# EAGLE design switch_v2 (EAGLE 7.3.0)
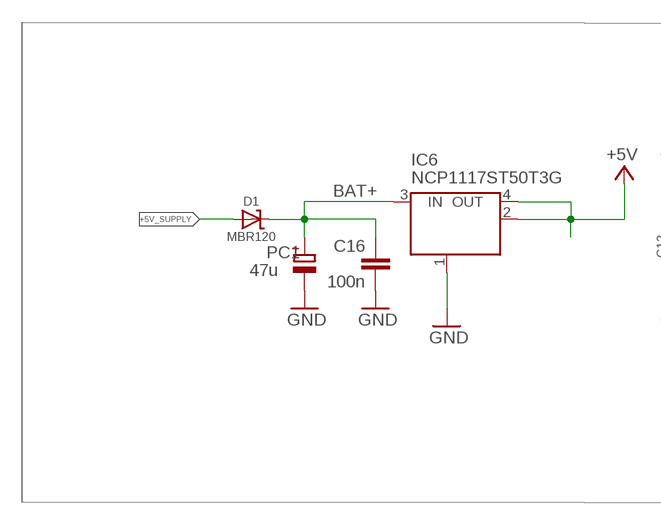
[diagram p0: schematic, sheet 1, part 1 of 2]
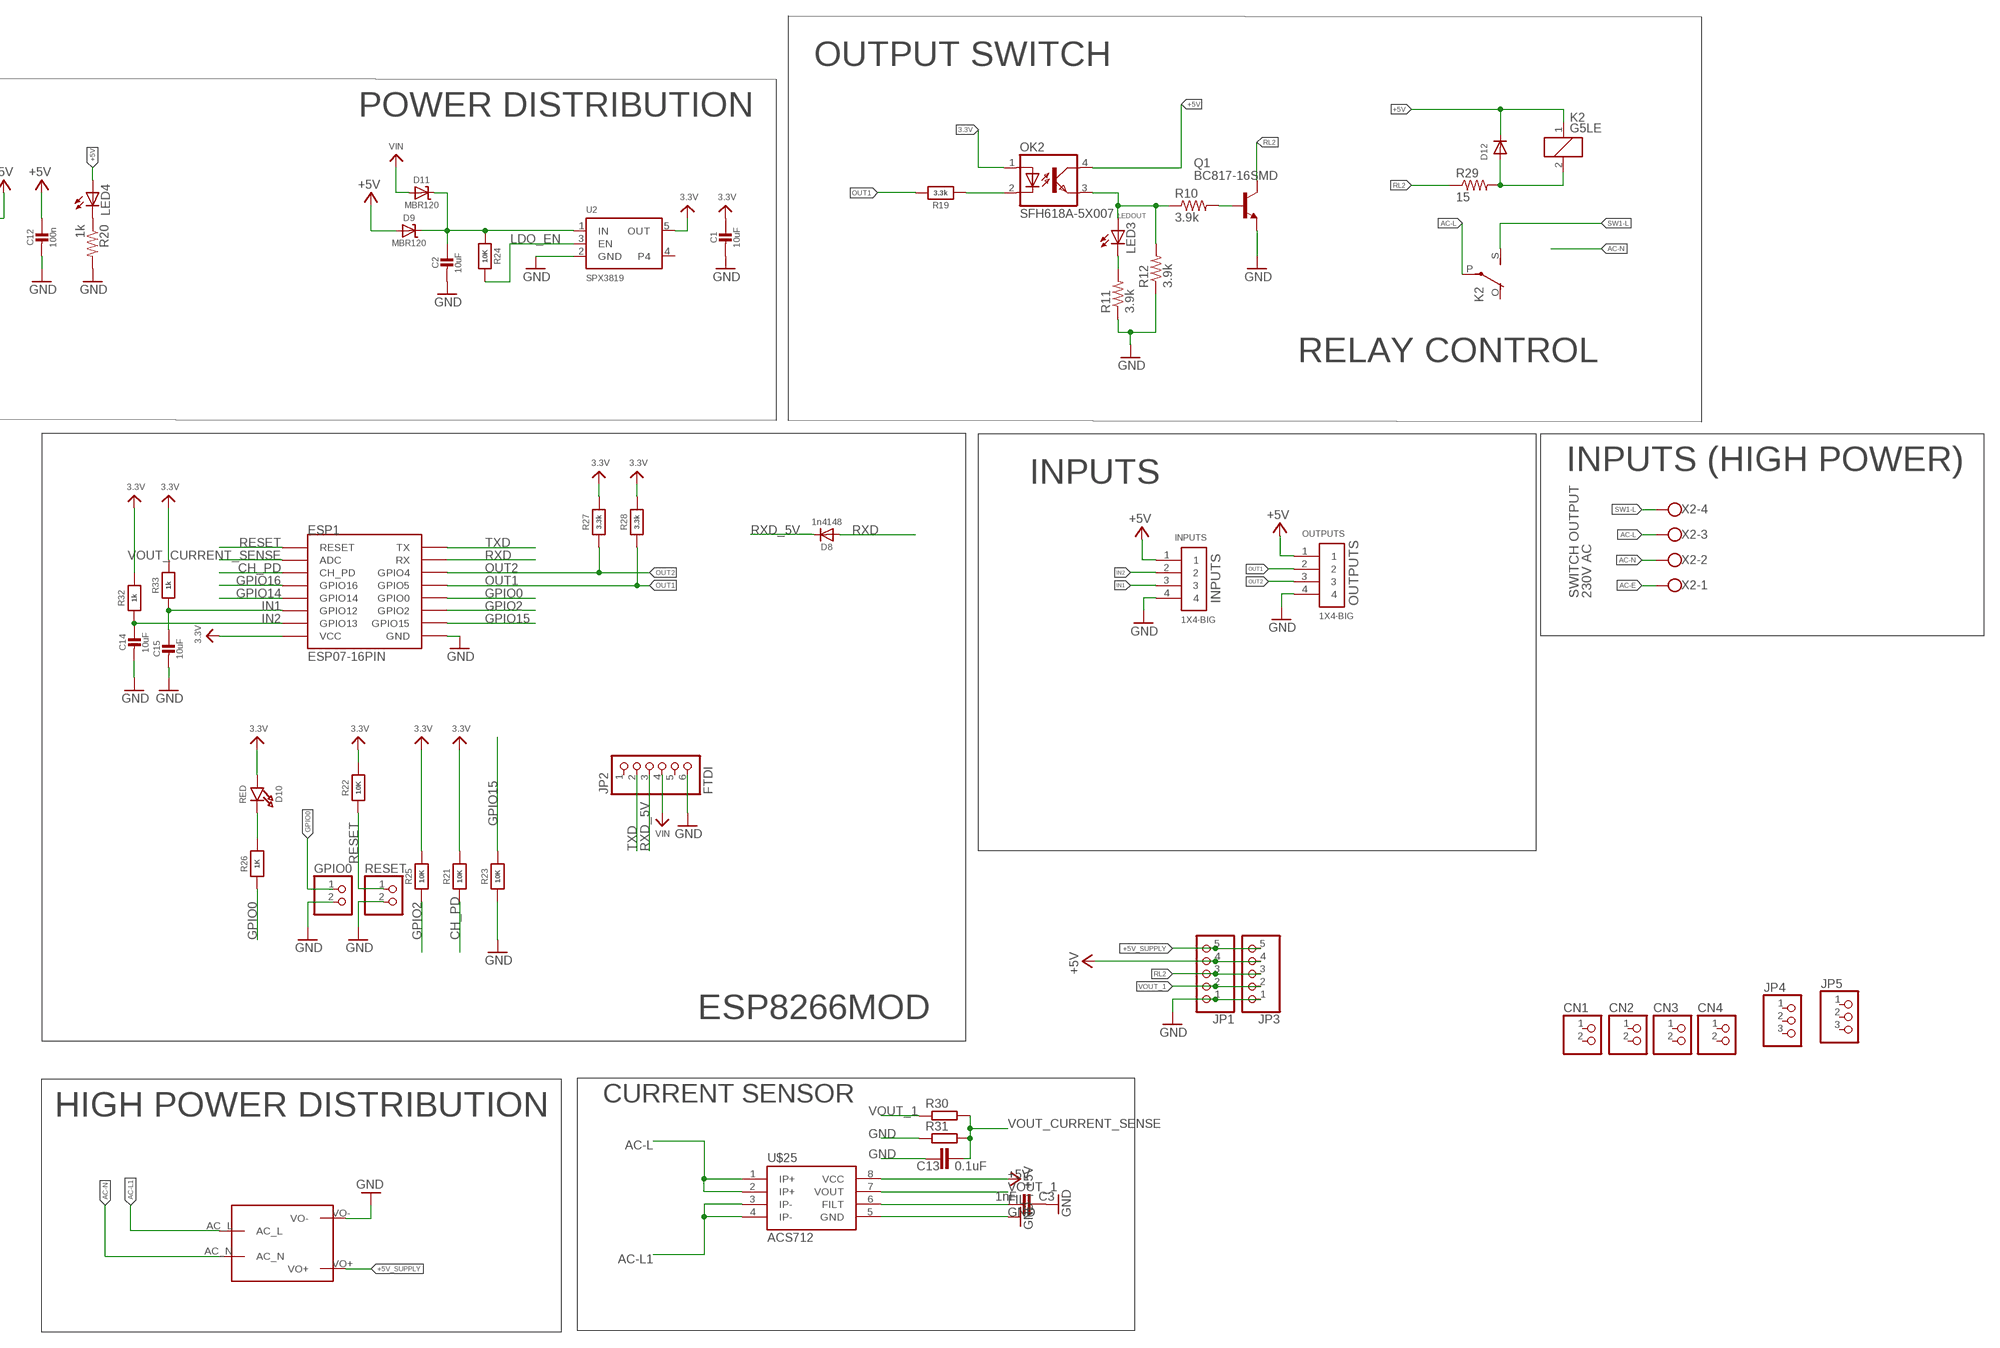
[diagram p1: schematic, sheet 1, part 2 of 2]

## Parts
C1  10uF  CAP_CERAMIC_0603  [_0603]
C2  10uF  CAP_CERAMIC_0603  [_0603]
C3  1nF  C-EU0603-RND  [C0603-ROUND]
C12  100n  CAP_CERAMIC_0603  [_0603]
C13  0.1uF  C-EU0603-RND  [C0603-ROUND]
C14  10uF  CAP_CERAMIC_0603  [_0603]
C15  10uF  CAP_CERAMIC_0603  [_0603]
C16  100n  C-EU0603-RND  [C0603-ROUND]
CN1  PINHD-1X2  [1X02]
CN2  PINHD-1X2  [1X02]
CN3  PINHD-1X2  [1X02]
CN4  PINHD-1X2  [1X02]
D1  MBR120  DIODE-SCHOTTKYSOD-123  [SOD-123]
D8  1n4148  DIODESOD-323  [SOD-323]
D9  MBR120  DIODE-SCHOTTKYSOD-123  [SOD-123]
D10  RED  LED0603_NOOUTLINE  [CHIPLED_0603_NOOUTLINE]
D11  MBR120  DIODE-SCHOTTKYSOD-123  [SOD-123]
D12  DIODESOD-523  [SOD-523]
ESP1  ESP07-16PIN  [ESP07-16PIN]
GPIO0  PINHD-1X2  [1X02]
IC6  NCP1117ST50T3G  MC33269ST-3.3T3  [SOT223]
INPUTS  1X4-BIG  [1X04-BIG]
JP1  PINHD-1X5  [1X05]
JP2  FTDI  HEADER-1X670MIL  [1X06_ROUND_70]
JP3  PINHD-1X5  [1X05]
JP4  PINHD-1X3  [1X03]
JP5  PINHD-1X3  [1X03]
K2  G5LE  [G5LE]
LED3  LEDCHIP-LED0603  [CHIP-LED0603]
LED4  LEDCHIP-LED0603  [CHIP-LED0603]
OK2  SFH618A-5X007  [SMD4-7]
OUTPUTS  1X4-BIG  [1X04-BIG]
PC1  47u  CPOL-EUD  [PANASONIC_D]
Q1  BC817-16SMD  [SOT23-BEC]
R10  3.9k  R-US_R0603  [R0603]
R11  3.9k  R-US_R0603  [R0603]
R12  3.9k  R-US_R0603  [R0603]
R19  3.3k  RESISTOR_0603MP  [_0603MP]
R20  1k  R-US_R0603  [R0603]
R21  10K  RESISTOR_0603_NOOUT  [0603-NO]
R22  10K  RESISTOR_0603_NOOUT  [0603-NO]
R23  10K  RESISTOR_0603_NOOUT  [0603-NO]
R24  10K  RESISTOR_0603_NOOUT  [0603-NO]
R25  10K  RESISTOR_0603_NOOUT  [0603-NO]
R26  1K  RESISTOR_0603_NOOUT  [0603-NO]
R27  3.3k  RESISTOR_0603  [_0603]
R28  3.3k  RESISTOR_0603  [_0603]
R29  15  R-US_R0603  [R0603]
R30  R-EU_R0603  [R0603]
R31  R-EU_R0603  [R0603]
R32  1k  RESISTOR_0603  [_0603]
R33  1k  RESISTOR_0603  [_0603]
RESET  PINHD-1X2  [1X02]
U2  SPX3819  VREG_SOT23-5  [SOT23-5]
U$24  MAINS_CONVERTERS  [HLK-PM01]
U$25  ACS712  [SO08]
X2  W237-4  [W237-4]

## Nets
3.3V: C1.1 D10.A ESP1.VCC OK2.1(A) R21.2 R22.2 R25.2 R27.2 R28.2 R32.2 R33.2 U2.5(OUT)
+5V: C12.1 D9.A D12.K(C) IC6.2(OUT) IC6.4(OUT) INPUTS.1 JP1.4 JP3.4 K2.1 LED4.A OK2.4(COL) OUTPUTS.1 U$25.8(VCC)
+5V_SUPPLY: D1.A JP1.5 JP3.5 U$24.VO+
AC-E: X2.1
AC-L: K2.P(2:P) U$25.1(IP+) U$25.2(IP+) X2.3
AC-L1: U$24.AC_L U$25.3(IP-) U$25.4(IP-)
AC-N: U$24.AC_N X2.2
BAT+ [power]: C16.1 D1.C IC6.3(IN) PC1.+
CH_PD: ESP1.CH_PD R21.1
FILT: C3.2 U$25.6(FILT)
GND: C1.2 C2.2 C3.1 C12.2 C13.1 C14.2 C15.2 C16.2 ESP1.GND GPIO0.2 IC6.1(GND/ADJ) INPUTS.4 JP1.1 JP2.6 JP3.1 OUTPUTS.4 PC1.- Q1.E R11.1 R12.1 R20.2 R23.1 R31.1 RESET.2 U2.2(GND) U$24.VO- U$25.5(GND)
GPIO0: ESP1.GPIO0 GPIO0.1 R26.1
GPIO2: ESP1.GPIO2 R25.1
GPIO14: ESP1.GPIO14
GPIO15: ESP1.GPIO15 R23.2
GPIO16: ESP1.GPIO16
IN1: C15.1 ESP1.GPIO12 INPUTS.3 R33.1
IN2: C14.1 ESP1.GPIO13 INPUTS.2 R32.1
LDO_EN: R24.2 U2.3(EN)
LEDOUT [power]: LED3.A OK2.3(EMIT) R10.1 R12.2
N$14: LED4.C R20.1
N$16: C2.1 D9.C D11.C R24.1 U2.1(IN)
N$26: D10.C R26.2
N$27 [power]: Q1.B R10.2
N$28 [power]: LED3.C R11.2
N$29: OK2.2(C) R19.1
N$30: D12.A K2.2 R29.2
OUT1: ESP1.GPIO5 OUTPUTS.2 R19.2 R28.1
OUT2: ESP1.GPIO4 OUTPUTS.3 R27.1
RESET: ESP1.REST(RESET) R22.1 RESET.1
RL2: JP1.3 JP3.3 Q1.C R29.1
RXD: D8.A ESP1.RX
RXD_5V: D8.C JP2.3
SW1-L: K2.S(2:S) X2.4
TXD: ESP1.TX JP2.2
VIN5V: D11.A JP2.4 ; supply symbol labelled VIN
VOUT_1: JP1.2 JP3.2 R30.1 U$25.7(VOUT)
VOUT_CURRENT_SENSE: C13.2 ESP1.ADC R30.2 R31.2
Unconnected: CN1.1 CN1.2 CN2.1 CN2.2 CN3.1 CN3.2 CN4.1 CN4.2 JP2.1 JP2.5 JP4.1 JP4.2 JP4.3 JP5.1 JP5.2 JP5.3 K2.O(2:O) U2.4

## Notes on the sheet
- OUTPUT SWITCH
- POWER DISTRIBUTION
- RELAY CONTROL
- INPUTS (HIGH POWER)
- INPUTS
- SWITCH OUTPUT | 230V AC
- INPUTS | OUTPUTS
- ESP8266MOD
- CURRENT SENSOR
- HIGH POWER DISTRIBUTION

## Library data of the parts
C1 C2 C12 C14 C15 = microbuilder:CAP_CERAMIC: Ceramic Capacitors For new designs, use the packages preceded by an '_' character since they are more reliable: The following footprints should be used on most boards: _0402 - Standard footprint for regular board layouts _0603 - Standard footprint for regular board layouts _0805 - Standard footprint for regular board layouts _1206 - Standard footprint for regular board layouts For extremely tight-pitch boards where space is at a premium, the following 'micro-pitch' footprints can be used (smaller pads, no silkscreen outline, etc.): _0402MP - Micro-pitch footprint for very dense/compact boards _0603MP - Micro-pitch footprint for very dense/compact boards _0805MP - Micro-pitch footprint for very dense/compact boards _1206MP - Micro-pitch footprint for very dense/compact boards
C3 C13 C16 = SmartPrj:C-EU: CAPACITOR, European symbol
CN1-CN4 GPIO0 RESET = pinhead:PINHD-1X2: PIN HEADER
D1 D9 D11 = microbuilder:DIODE-SCHOTTKY
D8 = microbuilder:DIODE: Diode
D10 = microbuilder:LED: LED
D12 = adafruit:DIODE: Diode
ESP1 = esp8266modules:ESP07-16PIN: ESP8266 Wifi module 07 - 16 pins; DIMENSIONS: 22.0 x 16.0 mm; PINS: 16; PITCH: 0.078" / 2 mm
IC6 = linear:MC33269ST*: Adjustable Output Low Dropout Voltage Regulator 800 mA Source: http://www.onsemi.com/pub/Collateral/MC33269-D.PDF
INPUTS OUTPUTS = adafruit:1X4: 4-pin connector
JP1 JP3 = pinhead:PINHD-1X5: PIN HEADER
JP2 = microbuilder:HEADER-1X6: PIN HEADER
JP4 JP5 = pinhead:PINHD-1X3: PIN HEADER
K2 = relay:G5LE: RELAY 1 x switch, 10 A/120 V AC, 8 A/30 V DC, Omron; OC_FARNELL: unknown; OC_NEWARK: unknown
LED3 LED4 = adafruit:LED: LED
OK2 = optocoupler:SFH618?*: Optocoupler, Phototransistor Output, Low Input Current Source: Data sheet <http://www.vishay.com/docs/83673/sfh618.pdf>; MPN: SFH618A-5X007; OC_FARNELL: unknown; OC_NEWARK: 43K9546
PC1 = rcl:CPOL-EU: POLARIZED CAPACITOR, European symbol
Q1 = transistor-npn:BC817*: NPN Transistor
R10-R12 R20 R29 = rcl:R-US_: RESISTOR, American symbol
R19 R21-R28 R32 R33 = microbuilder:RESISTOR: Resistors For new designs, use the packages preceded by an '_' character since they are more reliable: The following footprints should be used on most boards: _0402 - Standard footprint for regular board layouts _0603 - Standard footprint for regular board layouts _0805 - Standard footprint for regular board layouts _1206 - Standard footprint for regular board layouts For extremely tight-pitch boards where space is at a premium, the following 'micro-pitch' footprints can be used (smaller pads, no silkscreen outline, etc.): _0402MP - Micro-pitch footprint for very dense/compact boards _0603MP - Micro-pitch footprint for very dense/compact boards _0805MP - Micro-pitch footprint for very dense/compact boards _1206MP - Micro-pitch footprint for very dense/compact boards
R30 R31 = resistor:R-EU_: RESISTOR, European symbol
U2 = microbuilder:VREG_SOT23-5: SOT23-5 Fixed Voltage Regulators Part Current Out V Out V In V Dropout θJA (°C/W) TJ (°C) Digikey Part No. ADP121 150mA 3.3V 3.4-5.5V 0.09V @ 150mA -- -- ADP121-AUJZ33R7CT-ND ADP121 150mA 3.0V 3.1-5.5V 0.09V @ 150mA -- -- ADP121-AUJZ30R7CT-ND ADP122 300mA 3.3V 3.4-5.5V 0.085V @ 300mA -- -- ADP122AUJZ-3.3-R7CT-ND ADP1712 300mA 3.3V 3.5-5.5V 0.17V @ 300mA -- -- ADP1712AUJZ-3.3-R7TR-ND AP7311 (Low Cost) 150mA 3.3V 3.5-6V 0.15V @ 150mA -- -- AP7311-33WG-7DICT-ND LD39015M18R 150mA 1.8V 1.9V-5.5V 0.08V @ 100mA -- -- 497-6977-1-ND LP2985A-33DBVR 150mA 3.3V 3.3-16V 0.28V @ 150mA 206 150 296-18479-1-ND MCP1824T-3302E/OT 300mA 3.3V 3.5V-6V 0.2V @ 300mA -- -- MCP1824T-3302E/OTCT-ND MIC5205-2.5YM5 TR 150mA 2.5V 2.7-16V 0.165V @ 150mA -- -- 576-1257-2-ND MIC5205-3.0YM5 TR 150mA 3.0V 3.2V-16V 0.165V @ 150mA -- -- 576-1258-2-ND MIC5205-3.3YM5 TR 150mA 3.3V 3.5V-16V 0.165V @ 150mA -- -- 576-1259-2-ND TPS780330220 150mA 3.3V+2.2V 3.6-5.5V 250mV Max -- -- 296-23332-1-ND TDA3663/N1,135 100mA 3.3V 3.5-45V 0.18V @ 50mA -- -- 568-5343-1-ND Max operating temp can be calculated using θJA, TJ (max junction temperature), and power in watts. Set the "Maximum Ambient Temperature" until it reaches TJ ("Max Junction Temperature"), which is the absolute limit for safe use of the regulator: Heat Sink Temperature Calculator <http://www.daycounter.com/Calculators/Heat-Sink-Temperature-Calculator.phtml> For example, With 12V source into a 3.3V LP2985 and a 30mA load, we are dissipating (12V-3.3V) * 0.03A = 0.261W. With a θJA of 206 °C/W, a TJ of 150°C, and 261mW we can safely use the chip without a heat sink up to 75°C (=147.1°C Junction Temperature).
U$24 = captain-slow:MAINS_CONVERTERS
U$25 = SparkFun:ACS712
X2 = con-wago-500:W237-4: WAGO SCREW CLAMP; OC_FARNELL: unknown; OC_NEWARK: unknown

## Net classes
0 default: width 0.305 mm, drill 0.305 mm, clearance 0.203 mm
1 power: width 0.406 mm, drill 0.254 mm, clearance 0.152 mm
2 Massa: width 1.2 mm, drill 0.6 mm, clearance 0.2 mm
3 Mot: width 1.2 mm, drill 0.8 mm, clearance 0.005 mm
4 motor: width 0.305 mm, drill 0.406 mm, clearance 0.203 mm

## Board
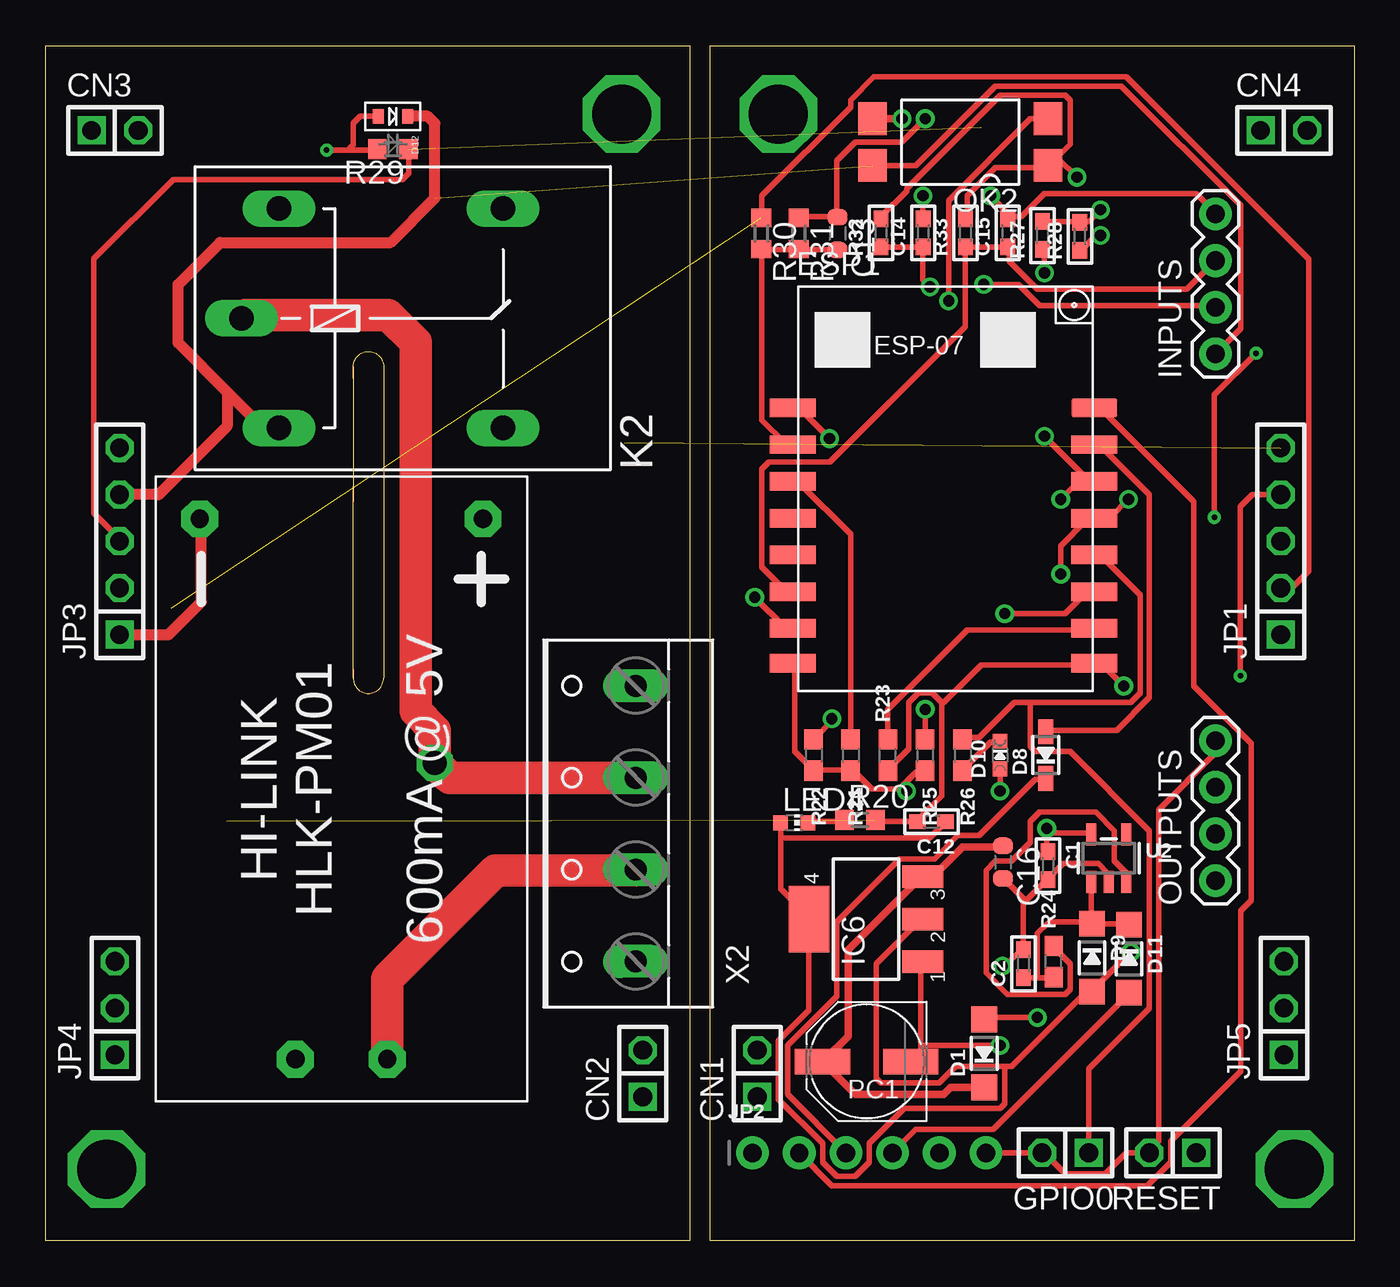
[diagram p2: board, top side]
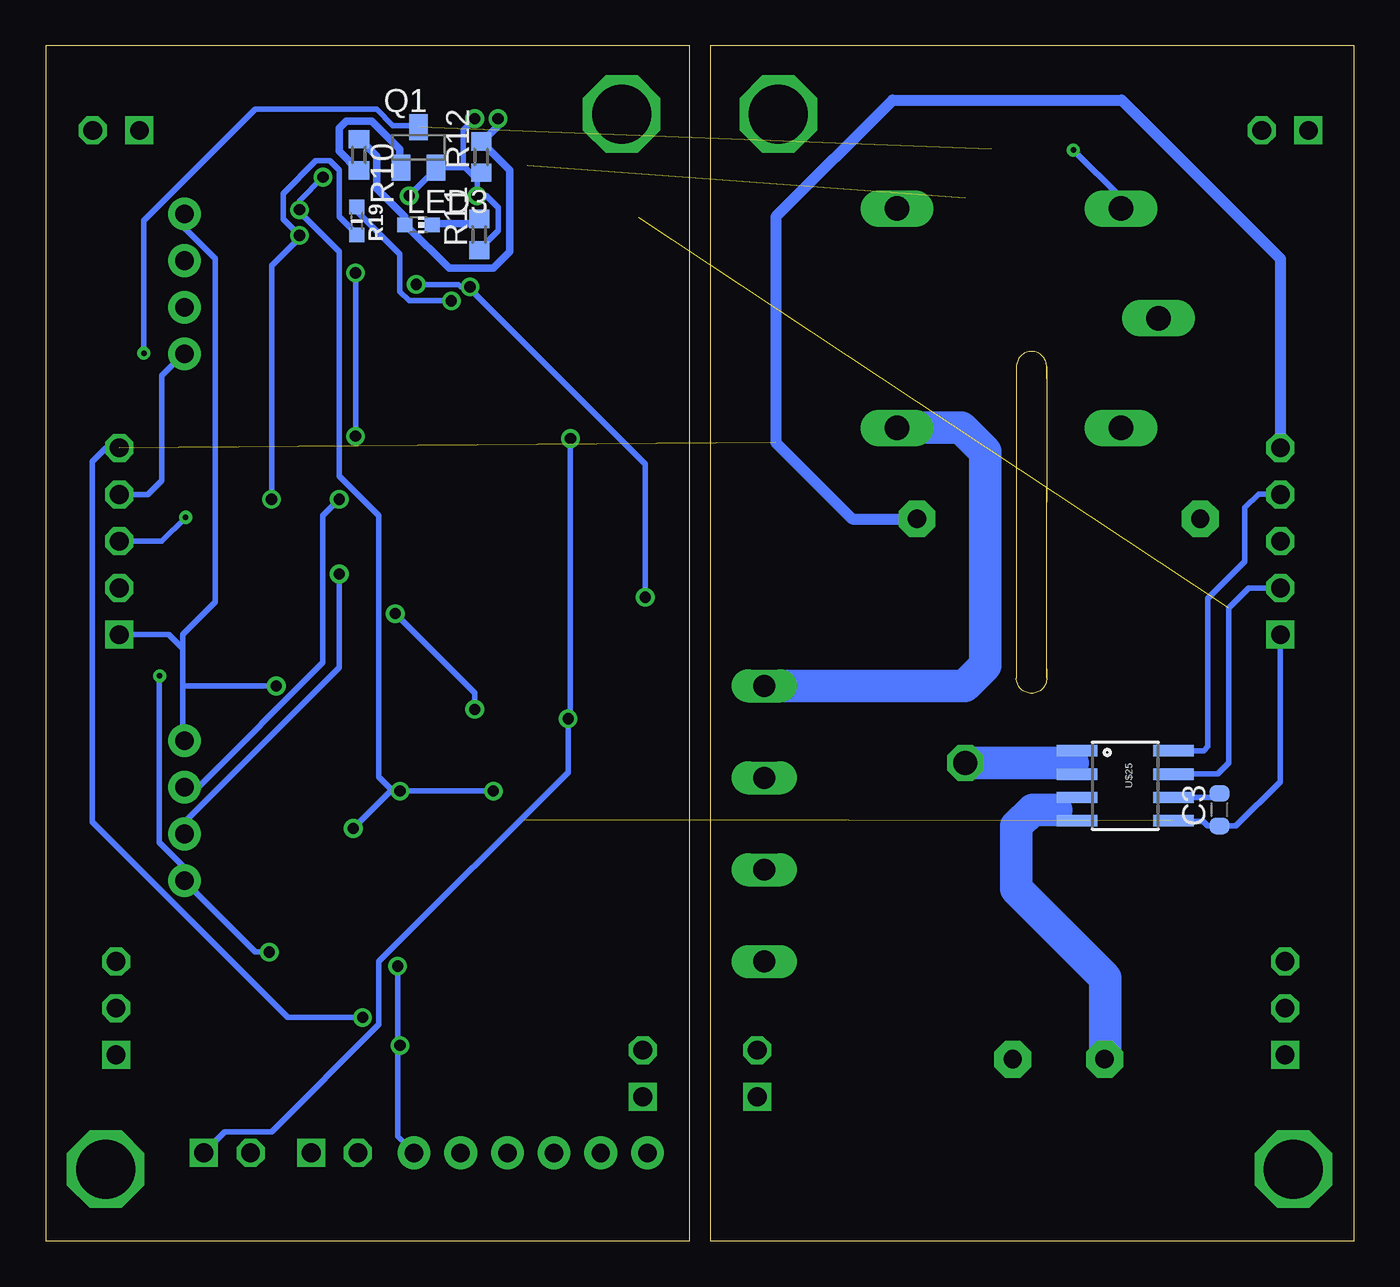
[diagram p3: board, bottom side, seen from below]

Size 71.14 x 65 mm. Coordinates in mm from the lower left corner, seen from the top.
Outline: 18.36,40.82 18.36,47.55 arc180 16.71,47.55
Outline: 18.36,41.65 18.36,30.6 arc-180 16.71,30.6
Outline: 16.71,30.6 16.71,41.02
Outline: 16.71,47.55 16.71,40.18
Outline: 16.71,46.91 16.71,47.55
Outline: 16.71,31.11 16.71,30.6
Outline: 36.14,0 36.14,65 71.14,65 71.14,0 36.14,0
Outline: 0,0 0,65 35,65 35,0 0,0
Copper layers (1*16): Top 0.035mm / dielectric 1.5mm / Bottom 0.035mm
Design rules "default": minimum track width 10mil, minimum drill 24mil, track to track 8mil, track to pad 8mil, pad to pad 8mil, via to via 8mil, smd to smd 8mil, copper to edge 40mil, drill to drill 8mil, minimum pad ring 10mil, minimum via ring 8mil, stop-mask expansion 4mil, vias tented up to drill 0mil, thermal gap 10mil

### Footprints (pad centres in the part's own frame; a part is rotated, then mirrored left to right if it is on the bottom)
_0603 = smd 0.9 x 0.8: 1 -0.762,0; 2 0.762,0
C0603-ROUND = smd 0.898 x 1.1: 1 -0.889,0; 2 0.889,0
1X02 = drill 1.016 square: 1 -1.27,0 | drill 1.016 octagon: 2 1.27,0
SOD-123 = smd 1.4 x 1.4: A 1.85,0; C -1.85,0
SOD-323 = smd 1.35 x 0.8: A 1.27,0; C -1.27,0
CHIPLED_0603_NOOUTLINE = smd 0.8 x 0.8: A 0,-0.75; C 0,0.75
SOD-523 = smd 0.8 x 0.6: A 0,-0.8; K 0,0.8
ESP07-16PIN = smd 2.5 x 1: ADC -8.2,3.8; CH_PD -8.2,1.8; GND 8.2,-8.105; GPIO0 8.2,-2.2; GPIO2 8.2,-4.2; GPIO4 8.2,1.8; GPIO5 8.2,-0.2; GPIO12 -8.2,-4.2; GPIO13 -8.2,-6.2; GPIO14 -8.2,-2.2; GPIO15 8.2,-6.2; GPIO16 -8.2,-0.2; REST -8.2,5.8; RX 8.2,3.8; TX 8.2,5.8; VCC -8.2,-8.105
SOT223 = smd 1.219 x 2.235: 1 -2.311,-3.099; 2 0,-3.099; 3 2.311,-3.099 | smd 3.6 x 2.2: 4 0,3.099
1X04-BIG = drill 1.016 pad 1.778: 1 0,0; 2 2.54,0; 3 5.08,0; 4 7.62,0
1X05 = drill 1.016 square: 1 -5.08,0 | drill 1.016 octagon: 2 -2.54,0; 3 0,0; 4 2.54,0; 5 5.08,0
1X06_ROUND_70 = drill 1 pad 1.778: 1 -6.35,0; 2 -3.81,0; 3 -1.27,0; 4 1.27,0; 5 3.81,0; 6 6.35,0
1X03 = drill 1.016 square: 1 -2.54,0 | drill 1.016 octagon: 2 0,0; 3 2.54,0
G5LE = drill 1.321 long: 1 -7.493,-5.969; 2 -7.493,5.969; O 4.699,5.969; P -9.525,0; S 4.699,-5.969
CHIP-LED0603 = smd 0.8 x 0.8: A 0,-0.75; C 0,0.75
SMD4-7 = smd 1.78 x 1.55: 1 -1.27,-4.77; 2 1.27,-4.77; 3 1.27,4.77; 4 -1.27,4.77
PANASONIC_D = smd 3 x 1.4: + 2.4,0; - -2.4,0
SOT23-BEC = smd 1 x 1.4: B -0.95,-1.1; C 0,1.1; E 0.95,-1.1
R0603 = smd 1 x 1.1: 1 -0.85,0; 2 0.85,0
_0603MP = smd 0.8 x 0.8: 1 -0.762,0; 2 0.762,0
0603-NO = smd 1.1 x 1: 1 -0.85,0; 2 0.85,0
SOT23-5 = smd 0.55 x 1.2: 1 -0.95,-1.3; 2 0,-1.3; 3 0.95,-1.3; 4 0.95,1.3; 5 -0.95,1.3
HLK-PM01 = drill 1 pad 2 octagon: AC_L -14.7,2.5; AC_N -14.7,-2.5; VO+ 14.7,-7.7; VO- 14.7,7.7
SO08 = smd 0.61 x 2.21: 1 -1.905,-2.616; 2 -0.635,-2.616; 3 0.635,-2.616; 4 1.905,-2.616; 5 1.905,2.616; 6 0.635,2.616; 7 -0.635,2.616; 8 -1.905,2.616
W237-4 = drill 1.194 long: 1 -7.5,-1.27; 2 -2.5,-1.27; 3 2.5,-1.27; 4 7.5,-1.27

### Placement (x,y rotation side)
C1  54.5,20.4 270 top
C2  53.16,15.06 90 top
C3  7.31,23.45 90 bottom
C12  48.16,22.8 180 top
C13  43.04,54.8 270 top
C14  47.71,54.82 90 top
C15  52.31,54.82 90 top
C16  52.04,20.59 270 top
CN1  38.68,9.1 90 top
CN2  32.46,9.1 90 top
CN3  3.75,60.4 0 top
CN4  67.33,60.4 0 top
D1  51.02,10.19 90 top
D8  54.38,26.42 90 top
D9  56.89,15.4 270 top
D10  51.89,26.42 0 top
D11  58.9,15.34 270 top
D12  18.87,61.17 270 top
ESP1  48.82,39.51 0 top
GPIO0  55.44,4.78 180 top
IC6  44.59,17.5 90 top
INPUTS  63.6,48.24 90 top
JP1  67.15,38.05 90 top
JP2  44.77,4.78 0 top
JP3  4.01,38.05 90 top
JP4  3.75,12.65 90 top
JP5  67.33,12.65 90 top
K2  20.16,50.18 0 top
LED3  50.88,55.26 270 bottom
LED4  40.7,22.73 270 top
OK2  49.73,59.77 90 top
OUTPUTS  63.6,19.59 90 top
PC1  44.63,9.75 180 top
Q1  50.87,59.48 0 bottom
R10  54.12,59.08 270 bottom
R11  47.58,54.74 90 bottom
R12  47.47,58.96 90 bottom
R19  54.23,55.48 270 bottom
R20  44.27,22.9 0 top
R21  43.76,26.42 270 top
R22  41.75,26.42 270 top
R23  45.79,26.42 90 top
R24  54.81,15.19 90 top
R25  47.8,26.42 270 top
R26  49.85,26.42 270 top
R27  54.19,54.68 90 top
R28  56.23,54.63 90 top
R29  18.87,59.39 180 top
R30  38.91,54.8 270 top
R31  40.94,54.8 270 top
R32  45.41,54.82 90 top
R33  50.01,54.82 90 top
RESET  61.28,4.78 180 top
U2  57.8,20.81 0 top
U$24  16.06,24.57 90 top
U$25  12.44,24.75 270 bottom
X2  30.8,22.68 90 top

### Tracks (layer width: path | path; a pad name or v marks a point on that pad's centre or on a via)
3.3V  (via drill 0.61)
  Top 0.305: R27.2 54.3,55.45 56.2,55.45 R28.2 56.33,55.45 56.71,55.45 v57.35,56.09 | R32.2 45.41,55.7 46.81,57.1 46.81,57.23 51.89,62.31 55.44,62.31 55.7,62.05 55.7,59.64 54.55,58.5 OK2.1 | R33.2 50.11,55.7 50.11,56.85 51.63,58.37 54.43,58.37 OK2.1 | v56.08,57.86 55.06,58.88 OK2.1 | v51.89,24.46 D10.A | C1.1 54.43,21.16 v54.43,22.43 54.55,22.18 56.84,22.18 U2.5 | 46.55,24.72 46.42,24.59 44.9,24.59 43.88,25.61 R21.2 43.76,25.61 41.85,25.61 R22.2 41.73,25.61 40.71,26.62 40.71,31.32 ESP1.VCC | 46.55,24.72 47.31,25.48 47.7,25.48 R25.2 | 46.55,24.72 v46.81,24.46
  Bottom 0.305: v56.08,57.86 57.35,56.59 v57.35,56.09 57.35,55.96 55.19,53.8 55.19,41.61 53.03,39.45 53.03,25.23 52.39,24.59 52.39,24.46 | 52.39,24.46 v51.89,24.46 v46.81,24.46 | v54.43,22.43 52.39,24.46
+5V  (via drill 0.3, 0.61)  (1 unrouted)
  Top 0.305: 39.95,21.92 39.95,19.13 41.47,17.61 IC6.4 41.47,17.35 41.47,12.53 39.82,10.87 39.82,7.7 42.23,5.29 42.23,4.27 43,3.51 44.01,3.51 44.77,4.27 44.77,5.29 46.68,7.19 51.89,7.19 52.14,7.45 52.14,9.48 | 39.95,21.92 39.95,22.68 LED4.A | 39.95,21.92 48.08,21.92 48.84,22.68 C12.1 | 52.14,9.48 49.47,9.48 48.58,8.59 45.41,8.59 45.16,8.84 45.16,15.06 47.57,17.48 IC6.2 | 52.14,9.48 52.52,9.48 56.58,13.54 56.84,13.54 D9.A 56.97,13.67 v59,15.7 | OK2.4 47.31,58.5 51.63,62.82 58.49,62.82 64.97,56.34 64.97,49.61 63.7,48.34 INPUTS.1 | v64.96,30.73 64.96,39.95 65.6,40.59 JP1.4
  Top 0.61: D12.K 20.77,61.17 21.15,60.78 21.15,56.72 18.74,54.31 9.47,54.31 7.18,52.02 7.18,48.85 9.85,46.18 | K2.1 11.81,44.22 9.85,46.18 | 9.85,46.18 9.85,44.31 6.13,40.59 JP3.4
  Bottom 0.305: U$25.8 8.16,26.66 7.94,26.88 7.94,34.94 5.93,36.95 5.93,39.87 5.18,40.63 4.04,40.63 JP3.4 | INPUTS.1 63.7,48.21 64.84,47.07 64.84,41.35 65.6,40.59 JP1.4 | v59,15.7 59.76,15.7 63.57,19.51 OUTPUTS.1 63.7,19.64 63.7,20.4 64.97,21.67 v64.97,30.72 v64.96,30.73
+5V_SUPPLY  (via drill 0.61)  (1 unrouted)
  Top 0.305: v53.92,12.14 51.12,12.14 D1.A
  Bottom 0.305: v53.92,12.14 57.98,12.14 68.62,22.78 68.62,42.4 67.88,43.13 JP1.5
  Bottom 0.61: JP3.5 4.01,53.42 12.64,62.05 25.09,62.05 31.44,55.7 31.44,43.41 27.3,39.27 U$24.VO+
AC-L  (via drill 1.3)
  Top 1.778: X2.3 21.95,25.18 v21.15,25.99 21.15,27.77 20.1,28.82 20.1,48.88 18.62,50.35 10.81,50.35 K2.P
  Bottom 0.305: U$25.2 14.93,25.35 15.31,25.99 15.25,26.62 U$25.1
  Bottom 1.778: v21.15,25.99 15.31,25.99
AC-L1
  Bottom 0.305: U$25.4 15.6,22.84 16.2,23.45 | U$25.3 15.78,24.11 16.45,23.45
  Bottom 1.778: U$24.AC_L 13.53,9.9 13.53,14.3 18.36,19.13 18.36,22.56 17.47,23.45 16.45,23.45 16.2,23.45
AC-N
  Top 1.778: X2.2 32.03,20.14 24.45,20.14 18.56,14.25 U$24.AC_N
BAT+
  Top 0.406: C16.1 52.01,21.41 49.85,21.41 48.33,19.89 47.7,19.89 IC6.3 47.57,19.76 43.63,15.83 43.63,11.13 42.36,9.86 PC1.+ 42.23,9.73 44.01,7.95 48.84,7.95 49.22,8.33 51,8.33 D1.C
CH_PD
  Top 0.305: R21.1 43.76,38.43 40.96,41.23 40.71,41.23 ESP1.CH_PD
FILT
  Bottom 0.305: U$25.6 7.53,24.11 C3.2
GND  (via drill 0.61)  (1 unrouted)
  Top 0.305: R31.1 40.96,55.7 43,55.7 C13.1 43,55.83 43,58.75 44.01,59.77 46.55,59.77 v47.82,61.04 | v47.7,56.85 47.7,55.7 C14.2 | INPUTS.4 63.57,55.96 62.55,56.98 54.3,56.98 53.03,55.7 52.39,55.7 C15.2 52.39,55.83 v51.38,56.85 | R20.2 45.16,22.81 47.31,22.81 C12.2 47.44,22.94 48.71,24.21 48.71,29.29 | 48.71,29.29 48.2,29.8 47.44,29.8 46.93,29.29 46.93,26.75 45.79,25.61 R23.1 | 48.71,29.29 48.84,29.29 50.87,31.32 56.97,31.32 ESP1.GND 57.09,31.32 57.47,31.32 v58.62,30.18 | 47.57,10.62 47.57,10.37 47.06,9.86 PC1.- | 47.57,10.62 47.57,15.06 IC6.1 | 53.16,18.49 53.16,18.62 52.14,19.64 C16.2 | 53.16,18.49 C2.2 53.03,15.83 52.14,14.94 v52.01,14.94 | 53.16,18.49 53.28,18.49 54.43,19.64 C1.2 54.55,19.76 55.31,20.53 57.22,20.53 57.73,20.02 57.73,19.51 U2.2 | JP2.6 GPIO0.2 54.3,4.78 55.44,3.63 57.6,3.63 58.74,4.78 RESET.2 60.01,4.91 60.52,5.41 60.52,23.45 63.57,26.5 63.57,27.13 OUTPUTS.4 | v51.89,10.62 47.57,10.62
  Top 0.61: JP3.1 6.67,32.97 8.45,34.75 8.45,39.18 U$24.VO-
  Bottom 0.305: U$25.5 9.79,22.81 8.2,22.81 7.94,22.56 C3.1 6.42,22.56 4.01,24.97 JP3.1 4.26,32.97 | R11.1 47.57,53.93 46.55,54.94 46.55,56.21 47.19,56.85 v47.7,56.85 47.7,57.86 47.57,57.99 R12.1 47.82,57.86 48.33,58.37 48.46,58.37 | 48.46,58.37 49.85,58.37 Q1.E 49.98,58.24 v51.38,56.85 | v47.82,61.04 48.46,60.4 48.46,58.37 | 63.7,30.18 63.7,27.26 OUTPUTS.4 | 63.7,30.18 63.7,32.21 | 52.01,10.62 52.01,5.67 JP2.6 | 52.01,10.62 v52.01,14.94 | v51.89,10.62 52.01,10.62 | 63.7,30.18 v58.62,30.18 | INPUTS.4 63.57,55.83 63.57,55.07 61.92,53.42 61.92,34.75 63.7,32.97 63.7,32.21 | 63.7,32.21 63.69,32.21 | 63.7,32.21 64.46,32.97 JP1.1
GPIO0
  Top 0.305: 53.54,29.29 59,29.29 59.51,29.8 59.51,35.13 57.35,37.29 57.09,37.29 ESP1.GPIO0 | 53.54,29.29 52.65,29.29 50.74,27.38 49.85,27.38 R26.1 | GPIO0.1 56.71,9.35 60.01,12.65 60.01,22.3 55.7,26.62 53.79,26.62 53.54,26.88 53.54,29.29
GPIO2  (via drill 0.61)
  Top 0.305: v47.82,28.91 47.82,27.38 R25.1 | v52.14,34.11 55.44,34.11 56.58,35.26 56.97,35.26 ESP1.GPIO2
  Bottom 0.305: v47.82,28.91 47.82,29.8 v52.14,34.11
GPIO15
  Top 0.305: R23.2 45.79,28.91 50.11,33.23 56.97,33.23 ESP1.GPIO15
IN1
  Top 0.305: INPUTS.3 63.57,53.29 62.05,51.77 53.92,51.77 52.39,53.29 52.39,53.93 C15.1 52.27,54.05 50.11,54.05 R33.1 49.98,53.93 49.98,49.74 42.61,42.37 39.31,42.37 38.93,41.99 38.93,36.66 40.2,35.38 40.58,35.38 ESP1.GPIO12
IN2  (via drill 0.61)
  Top 0.305: R32.1 47.7,54.05 C14.1 47.7,53.93 47.7,52.28 v48.08,51.9 | v51,52.02 52.9,52.02 54.05,50.88 63.57,50.88 INPUTS.2 | v38.55,35 40.2,33.35 40.58,33.35 ESP1.GPIO13
  Bottom 0.305: v51,52.02 48.71,52.02 48.58,51.9 v48.08,51.9 48.08,51.77 38.55,42.24 v38.55,35
LDO_EN
  Top 0.305: R24.2 54.81,15.95 55.7,15.06 55.7,13.67 55.44,13.41 52.27,13.41 51.12,14.56 51.12,20.14 51.63,20.65 52.52,20.65 53.54,21.67 53.54,22.81 54.05,23.32 57.09,23.32 58.11,22.3 58.11,20.65 58.74,20.02 U2.3
LEDOUT  (via drill 0.61)
  Top 0.406: v46.55,61.04 OK2.3
  Bottom 0.406: R10.1 54.05,59.9 53.16,59.01 53.16,57.23 51.63,55.7 51.63,55.32 LED3.A 51.5,55.2 49.22,52.91 46.81,52.91 45.92,53.8 45.92,58.24 47.44,59.77 R12.2 47.31,59.9 46.55,60.66 v46.55,61.04
N$1  (via drill 3.2)
  other vias: 67.89,3.89
N$2  (via drill 3.2)
  other vias: 39.83,61.29
N$3  (via drill 3.2)
  other vias: 31.31,61.29
N$5  (via drill 3.2)
  other vias: 3.3,3.89
N$14
  Top 0.305: LED4.C 41.47,22.81 43.38,22.81 R20.1
N$16
  Top 0.305: 53.92,14.3 54.81,14.3 R24.1 | 53.92,14.3 C2.1 | U2.1 56.84,19.38 56.84,17.35 D9.C | D11.C 58.87,17.22 56.97,17.22 D9.C | 53.92,14.3 53.92,16.72 54.55,17.35 56.71,17.35 D9.C
N$26
  Top 0.305: D10.C 51.89,27.13 51.38,27.13 49.85,25.61 R26.2
N$27
  Bottom 0.406: R10.2 54.17,58.24 55.19,59.26 55.19,60.53 54.81,60.91 53.41,60.91 51.89,59.39 51.89,58.5 Q1.B
N$28
  Bottom 0.406: LED3.C 50.11,55.32 47.95,55.32 47.7,55.58 R11.2
N$29  (via drill 0.61)
  Top 0.305: v49.09,51.13 49.09,56.59 53.54,61.04 OK2.2
  Bottom 0.305: v49.09,51.13 51.38,51.13 51.89,51.64 51.89,53.67 54.17,55.96 54.17,56.21 R19.1
N$30  (via drill 0.3)
  Top 0.305: R29.2 17.97,59.34 17.01,59.34 | D12.A 17.09,61.17 16.71,60.78 16.71,59.64 16.41,59.34 | 17.01,59.34 17.09,59.34 | 17.01,59.34 16.41,59.34 | v15.26,59.34 16.3,59.34 16.41,59.34
  Bottom 0.305: v15.26,59.34 12.67,56.75 K2.2
OUT1  (via drill 0.61)
  Top 0.305: v57.35,54.69 57.09,54.69 56.33,53.93 R28.1 | v58.87,40.34 57.85,39.32 57.09,39.32 ESP1.GPIO5 56.97,39.2 56.58,39.2 55.19,37.8 v55.19,36.27
  Bottom 0.305: R19.2 54.3,54.82 55.19,55.7 55.19,58.24 55.7,58.75 56.46,58.75 58.24,56.98 58.24,55.58 v57.35,54.69 57.35,54.56 58.87,53.04 v58.87,40.34 | v55.19,36.27 55.19,31.19 63.57,22.81 63.57,22.18 OUTPUTS.2
OUT2  (via drill 0.61)
  Top 0.305: v54.3,52.66 54.3,53.8 R27.1 | 56.46,41.61 56.71,41.35 56.97,41.35 ESP1.GPIO4 56.46,41.61 | 56.46,41.61 v54.3,43.77 | 56.46,41.61 v55.19,40.34
  Bottom 0.305: v54.3,43.77 v54.3,52.66 | v55.19,40.34 56.08,39.45 56.08,31.45 62.81,24.72 63.57,24.72 OUTPUTS.3
RESET  (via drill 0.61)
  Top 0.305: v42.74,28.4 42.74,28.27 41.85,27.38 R22.1 | v42.61,43.64 40.96,45.29 40.71,45.29 ESP1.REST
  Bottom 0.305: RESET.1 61.41,5.92 58.87,5.92 53.03,11.76 53.03,15.19 42.74,25.48 v42.74,28.4 42.61,28.4 v42.61,43.64
RL2  (via drill 0.3)  (1 unrouted)
  Top 0.305: R29.1 19.72,58.08 19.37,57.74 6.93,57.74 2.61,53.42 2.61,39.58 4.01,38.18 JP3.3 | v65.81,48.29 63.55,46.02 v63.55,39.35
  Bottom 0.305: Q1.C 51,60.66 52.27,60.66 53.16,61.55 59.76,61.55 65.81,55.5 v65.81,48.29 | v63.55,39.35 64.85,38.05 JP1.3
RXD
  Top 0.305: D8.A 54.43,27.77 58.24,27.77 60.01,29.54 60.01,40.59 57.35,43.26 57.09,43.26 ESP1.RX
RXD_5V
  Top 0.305: JP2.3 40.33,7.95 40.33,10.62 43,13.29 43,17.35 46.42,20.78 48.33,20.78 49.6,22.05 50.74,22.05 53.79,25.1 54.3,25.1 D8.C
SW1-L
  Bottom 1.778: X2.4 21.16,30.18 20.06,31.29 20.06,42.93 21.36,44.23 K2.S
TXD
  Top 0.305: JP2.2 42.74,3 59.89,3 61.16,4.27 61.16,5.41 64.97,9.22 64.97,17.93 65.55,18.51 65.55,27.06 62.43,30.18 62.43,40.21 57.35,45.29 57.09,45.29 ESP1.TX
VIN5V
  Top 0.305: JP2.4 47.31,6.05 51.5,6.05 58.87,13.41 D11.A
VOUT_1  (1 unrouted)
  Top 0.305: R30.1 38.93,55.7 38.93,56.85 43.76,61.67 43.76,62.05 45.03,63.33 58.74,63.33 68.66,53.41 68.66,36.43 67.74,35.51 JP1.2
  Bottom 0.305: U$25.7 7.4,25.39 6.8,25.99 6.8,34.41 5.71,35.5 JP3.2
VOUT_CURRENT_SENSE
  Top 0.305: C13.2 43,53.93 41.09,53.93 R31.2 40.84,53.93 38.93,53.93 R30.2 38.93,53.8 38.93,44.66 40.2,43.39 40.58,43.39 ESP1.ADC